# Altium schematic sheet Main.SchDoc
size A4; SheetNumber: 1; SheetTotal: 1
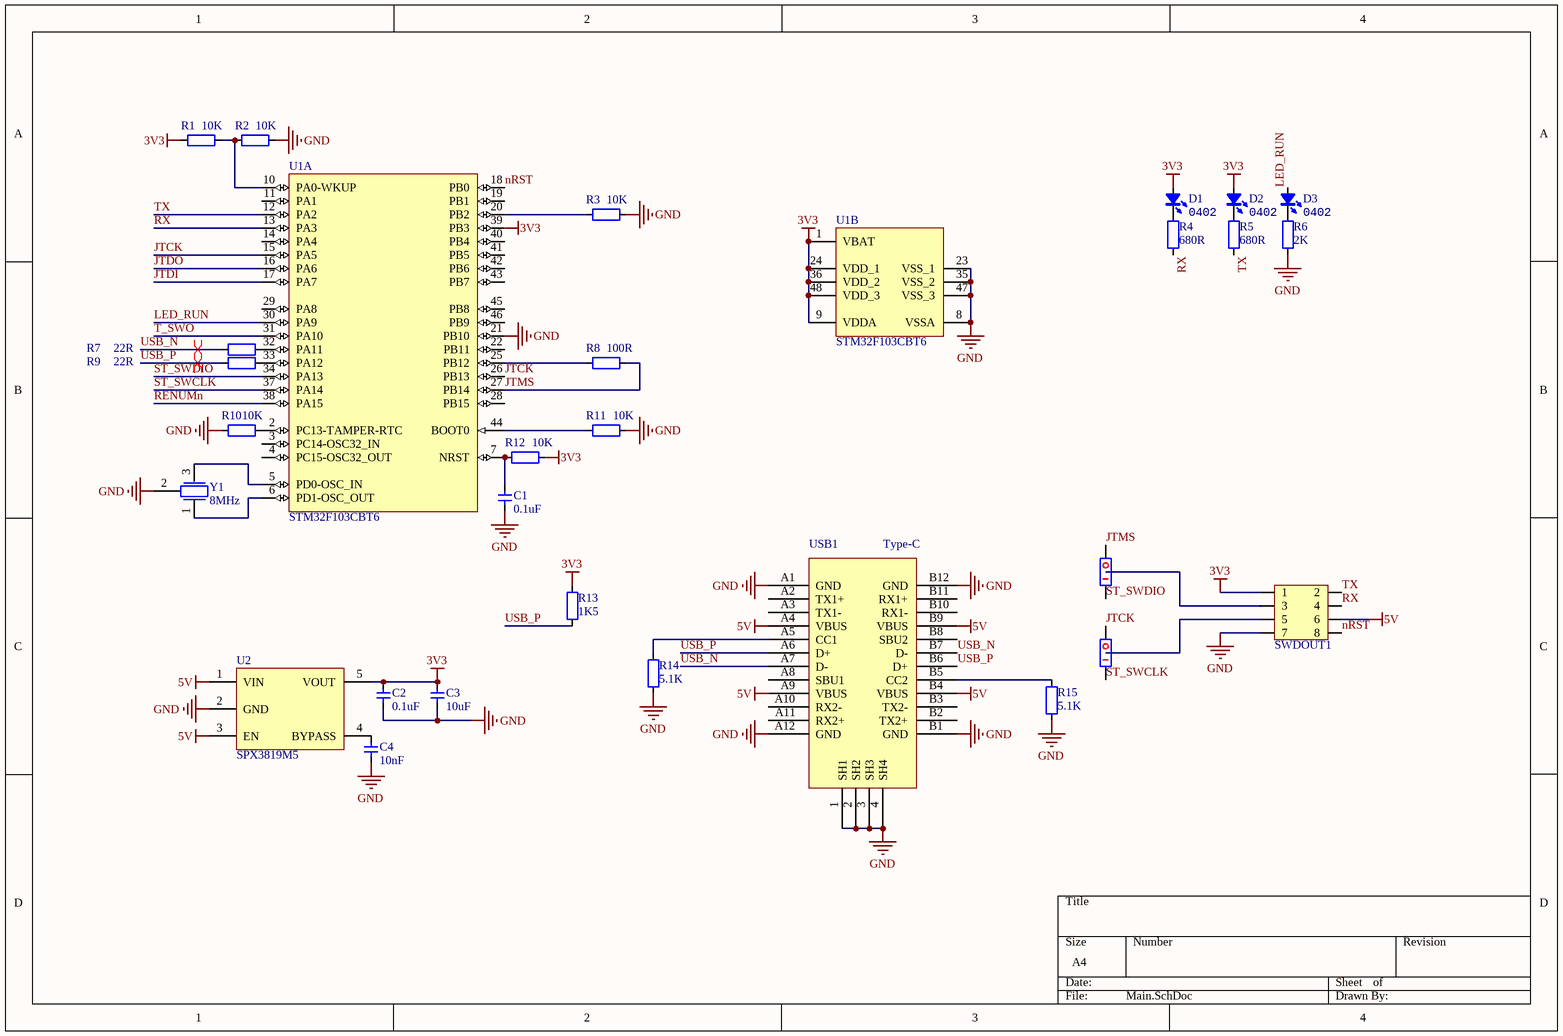
[diagram p0: Main.SchDoc]

## Parts
C1  0.1uF  [CAP_0402]
C2  0.1uF  [CAP_0402]
C3  10uF  [CAP_0402]
C4  10nF  [CAP_0402]
D1  Type: 0402  [LED_0402_BLUE]  (hidden comment: color?)
D2  Type: 0402  [LED_0402_YELLOW]  (hidden comment: color?)
D3  Type: 0402  [LED_0402_GREEN]  (hidden comment: color?)
J1  选择跳线  [jumper-3]  (value not drawn)
J2  选择跳线  [jumper-3]  (value not drawn)
R1  10K  [RES_0402]
R2  10K  [RES_0402]
R3  10K  [RES_0402]
R4  680R  [RES_0402]
R5  680R  [RES_0402]
R6  2K  [RES_0402]
R7  22R  [RES_0402]
R8  100R  [RES_0402]
R9  22R  [RES_0402]
R10  10K  [RES_0402]
R11  10K  [RES_0402]
R12  10K  [RES_0402]
R13  1K5  [RES_0402]
R14  5.1K  [RES_0402]
R15  5.1K  [RES_0402]
SWDOUT1  HDR2x4_2.54  [HDR2X4_2.54_180H]  (value not drawn)
U1  STM32F103CBT6  [LQFP-48]  (parts A,B of 2)
U2  SPX3819M5  [SOT23-5]
USB1  Type-C  [Type-C-TOP]
Y1  8MHz  [晶振-3P]

## Nets
3V3: C2.2 C3.2 D1.1(A) D2.1(A) R1.1 R12.2 R13.2 SWDOUT1.1 U1.1(VBAT) U1.9(VDDA) U1.24(VDD_1) U1.36(VDD_2) U1.39(PB3) U1.48(VDD_3) U2.5(VOUT)
5V: SWDOUT1.6 U2.1(VIN) U2.3(EN) USB1.A4(VBUS) USB1.A9(VBUS) USB1.B4(VBUS) USB1.B9(VBUS)
GND: C1.1 C2.1 C3.1 C4.1 R2.2 R3.2 R6.1 R10.1 R11.2 R14.2 R15.2 SWDOUT1.7 U1.8(VSSA) U1.21(PB10) U1.23(VSS_1) U1.35(VSS_2) U1.47(VSS_3) U2.2(GND) USB1.1(SH1) USB1.2(SH2) USB1.3(SH3) USB1.4(SH4) USB1.A1(GND) USB1.A12(GND) USB1.B1(GND) USB1.B12(GND) Y1.2
JTCK: J2.1 U1.15(PA5) U1.26(PB13)
JTDI: U1.17(PA7)
JTDO: U1.16(PA6)
JTMS: J1.1 R8.2 U1.27(PB14)
LED_RUN: D3.1(A) U1.30(PA9)
nRST: SWDOUT1.8 U1.18(PB0)
RENUMn: U1.38(PA15)
RX: R4.1 SWDOUT1.4 U1.13(PA3)
ST_SWCLK: J2.3 U1.37(PA14)
ST_SWDIO: J1.3 U1.34(PA13)
T_SWO: U1.31(PA10)
TX: R5.1 SWDOUT1.2 U1.12(PA2)
USB_N: R7.1 USB1.A7(D-) USB1.B7(D-)
USB_P: R9.1 R13.1 USB1.A6(D+) USB1.B6(D+)
NetC1_2: C1.2 R12.1 U1.7(NRST)
NetC4_2: C4.2 U2.4(BYPASS)
NetD1_2: D1.2(K) R4.2
NetD2_2: D2.2(K) R5.2
NetD3_2: D3.2(K) R6.2
NetJ1_2: J1.2 SWDOUT1.3
NetJ2_2: J2.2 SWDOUT1.5
NetR1_2: R1.2 R2.1 U1.10(PA0-WKUP)
NetR3_1: R3.1 U1.20(PB2)
NetR7_2: R7.2 U1.32(PA11)
NetR8_1: R8.1 U1.25(PB12)
NetR9_2: R9.2 U1.33(PA12)
NetR10_2: R10.2 U1.2(PC13-TAMPER-RTC)
NetR11_1: R11.1 U1.44(BOOT0)
NetR14_1: R14.1 USB1.A5(CC1)
NetR15_1: R15.1 USB1.B5(CC2)
NetU1_5: U1.5(PD0-OSC_IN) Y1.3
NetU1_6: U1.6(PD1-OSC_OUT) Y1.1

Not connected (* = marked no-connect by the designer): U1 3(PC14-OSC32_IN) 4(PC15-OSC32_OUT) 11(PA1) 14(PA4) 19(PB1) 22(PB11) 28(PB15) 29(PA8) 40(PB4) 41(PB5) 42(PB6) 43(PB7) 45(PB8) 46(PB9); USB1 A2(TX1+) A3(TX1-) A8(SBU1) A10(RX2-) A11(RX2+) B2(TX2+) B3(TX2-) B8(SBU2) B10(RX1-) B11(RX1+)

## Layout directives
differential pair: USB_N, USB_P

## Library data of the parts
C1-C4 = 电容-0402: Capacitor; Value: 0.1u
D1-D3 = LED_0402: LED; Value: color?
J1 J2 = 选择跳线: Resistor; Published: 8-Jun-2000; LatestRevisionDate: 17-Jul-2002; LatestRevisionNote: Re-released for DXP Platform.; PackageReference: AXIAL-0.4; Publisher: Altium Limited; PackageDescription: Axial Device, Thru-Hole; 2 Leads; 0.4 in Pin Spacing
R1-R6 R8 R10-R15 = 电阻-0402: Resistor; Value: 22R
R7 R9 = 电阻-0402: Resistor; Value: 22R
SWDOUT1 = HDR2x4_2.54: Header
U1 = STM32F103CBT6: ARM Cortex-M3 32-bit MCU, 128 KB Flash, 20 KB Internal RAM, 37 I/Os, 48-pin LQFP, -40 to 85 degC, Tray; A/D Converter: 2x12-bit (10 Channel); FLASH Size (Prog) (kB): 128; I/Os (High Current): 37; Internal RAM Size (kB): 20; Operating Frequency(F) (Processor speed) (MHz): 72; Supply Voltage(Vcc) min (V): 2; DatasheetVersion: Rev. 16; PackageVersion: Rev. 6, 06/2013; PackageReference: LQFP48; PackageDescription: 48-Pin Low Profile Quad Flat Package, 7 x 7 mm Body, 0.5 mm Pitch; Supplier 1: Digi-Key; Supplier Part Number 1: 497-6288-ND; Supplier 2: Farnell; Supplier Part Number 2: 1606327; Core: ARM Cortex-M3; Packing: Tray; Mounting Technology: Surface Mount; PartNumber: STM32F103CBT6; ComponentLink1Description: Manufacturer URL; ComponentLink1URL: http://www.st.com/web/en/home.html; ComponentLink2Description: Datasheet; ComponentLink2URL: http://www.st.com/st-web-ui/static/active/en/resource/technical/document/datasheet/CD00161566.pdf; ComponentLink3Description: Package Specification; ComponentLink3URL: http://www.st.com/st-web-ui/static/active/en/resource/technical/document/datasheet/DM00058181.pdf; Supplier 3: Newark; Supplier Part Number 3: 11N8296; Supplier 4: Newark; Supplier Part Number 4: 57P1214; Supplier 5: Mouser; Supplier Part Number 5: 511-STM32F103CBT6
U2 = SPX3819M5: LDO
USB1 = USB-Type-C-TOP
Y1 = 晶振-3Pin: 村田贴片